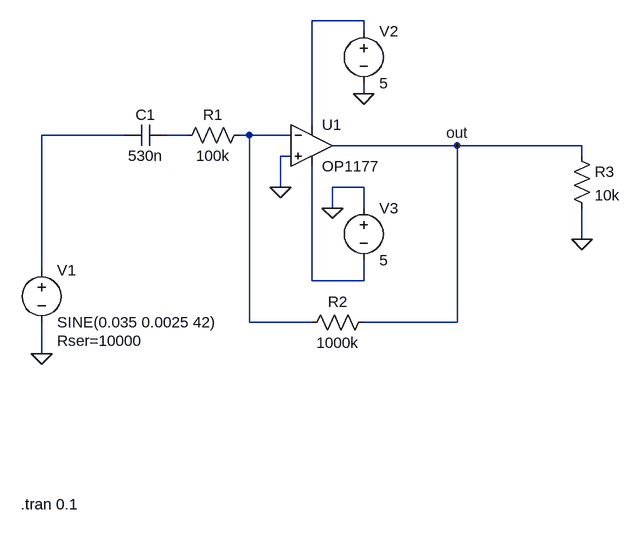
[diagram p0: schematic radar_amp.asc]
radar_amp.asc, the LTspice schematic file:
Version 4
SHEET 1 992 680
WIRE 592 -192 512 -192
WIRE 592 -176 592 -192
WIRE 592 -80 592 -96
WIRE 512 -32 512 -192
WIRE 224 -16 96 -16
WIRE 320 -16 288 -16
WIRE 416 -16 400 -16
WIRE 480 -16 416 -16
WIRE 736 0 544 0
WIRE 928 0 736 0
WIRE 480 16 464 16
WIRE 928 16 928 0
WIRE 464 64 464 16
WIRE 592 64 544 64
WIRE 544 96 544 64
WIRE 592 96 592 64
WIRE 928 144 928 96
WIRE 96 192 96 -16
WIRE 512 208 512 32
WIRE 592 208 592 176
WIRE 592 208 512 208
WIRE 416 272 416 -16
WIRE 512 272 416 272
WIRE 736 272 736 0
WIRE 736 272 592 272
WIRE 96 320 96 272
FLAG 96 320 0
FLAG 592 -80 0
FLAG 544 96 0
FLAG 736 0 out
FLAG 928 144 0
FLAG 464 64 0
SYMBOL voltage 96 176 R0
WINDOW 123 0 0 Left 0
WINDOW 39 24 124 Left 2
SYMATTR SpiceLine Rser=10000
SYMATTR InstName V1
SYMATTR Value SINE(0.035 0.0025 42)
SYMBOL cap 288 -32 R90
WINDOW 0 0 32 VBottom 2
WINDOW 3 32 32 VTop 2
SYMATTR InstName C1
SYMATTR Value 530n
SYMBOL res 416 -32 R90
WINDOW 0 0 56 VBottom 2
WINDOW 3 32 56 VTop 2
SYMATTR InstName R1
SYMATTR Value 100k
SYMBOL res 608 256 R90
WINDOW 0 0 56 VBottom 2
WINDOW 3 32 56 VTop 2
SYMATTR InstName R2
SYMATTR Value 1000k
SYMBOL Opamps\\OP1177 512 -64 R0
SYMATTR InstName U1
SYMBOL voltage 592 -192 R0
WINDOW 123 0 0 Left 0
WINDOW 39 0 0 Left 0
SYMATTR InstName V2
SYMATTR Value 5
SYMBOL voltage 592 80 R0
WINDOW 123 0 0 Left 0
WINDOW 39 0 0 Left 0
SYMATTR InstName V3
SYMATTR Value 5
SYMBOL res 912 0 R0
SYMATTR InstName R3
SYMATTR Value 10k
TEXT 64 552 Left 2 !.tran 0.1

The netlist it stands for:
* radar_amp.asc
V1 N002 0 SINE(0.035 0.0025 42) Rser=10000
C1 N003 N002 530n
R1 N004 N003 100k
R2 out N004 1000k
XU1 0 N004 N001 N005 out OP1177  ; pins In+ In- V+ V- OUT
V2 N001 0 5
V3 0 N005 5
R3 out 0 10k
.tran 0.1
.lib ADI1.lib
.backanno
.end